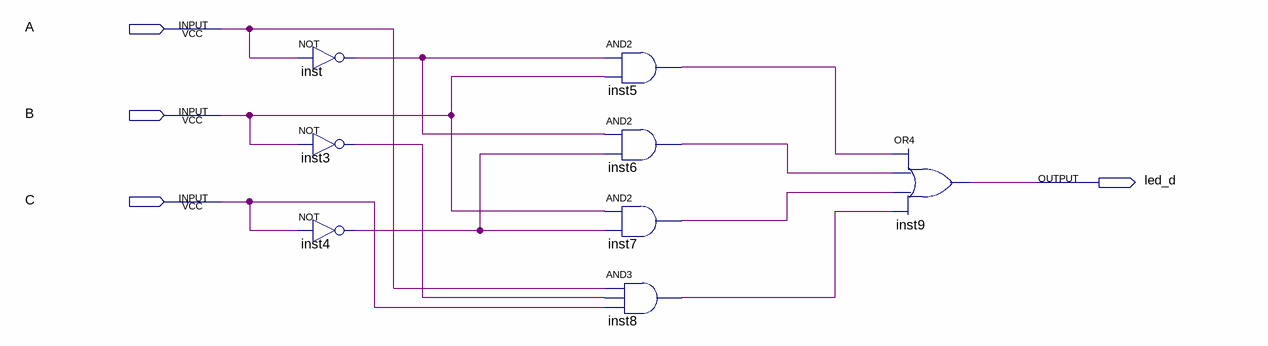
[diagram p0: schematic sheet]
// Quartus schematic led_d.bdf as structural Verilog: 8 symbols, 4 pins
module led_d (
  input  A,
  input  B,
  input  C,
  output led_d
);

  wire inst3_out, inst4_out, inst5_out, inst6_out, inst7_out, inst8_out, inst_out;

  not inst (inst_out, A);
  not inst3 (inst3_out, B);
  not inst4 (inst4_out, C);
  and inst5 (inst5_out, inst_out, B);
  and inst6 (inst6_out, inst_out, inst4_out);
  and inst7 (inst7_out, B, inst4_out);
  and inst8 (inst8_out, A, inst3_out, C);
  or inst9 (led_d, inst5_out, inst6_out, inst7_out, inst8_out);
endmodule
